# EAGLE design jat501 (EAGLE 9.5.1)
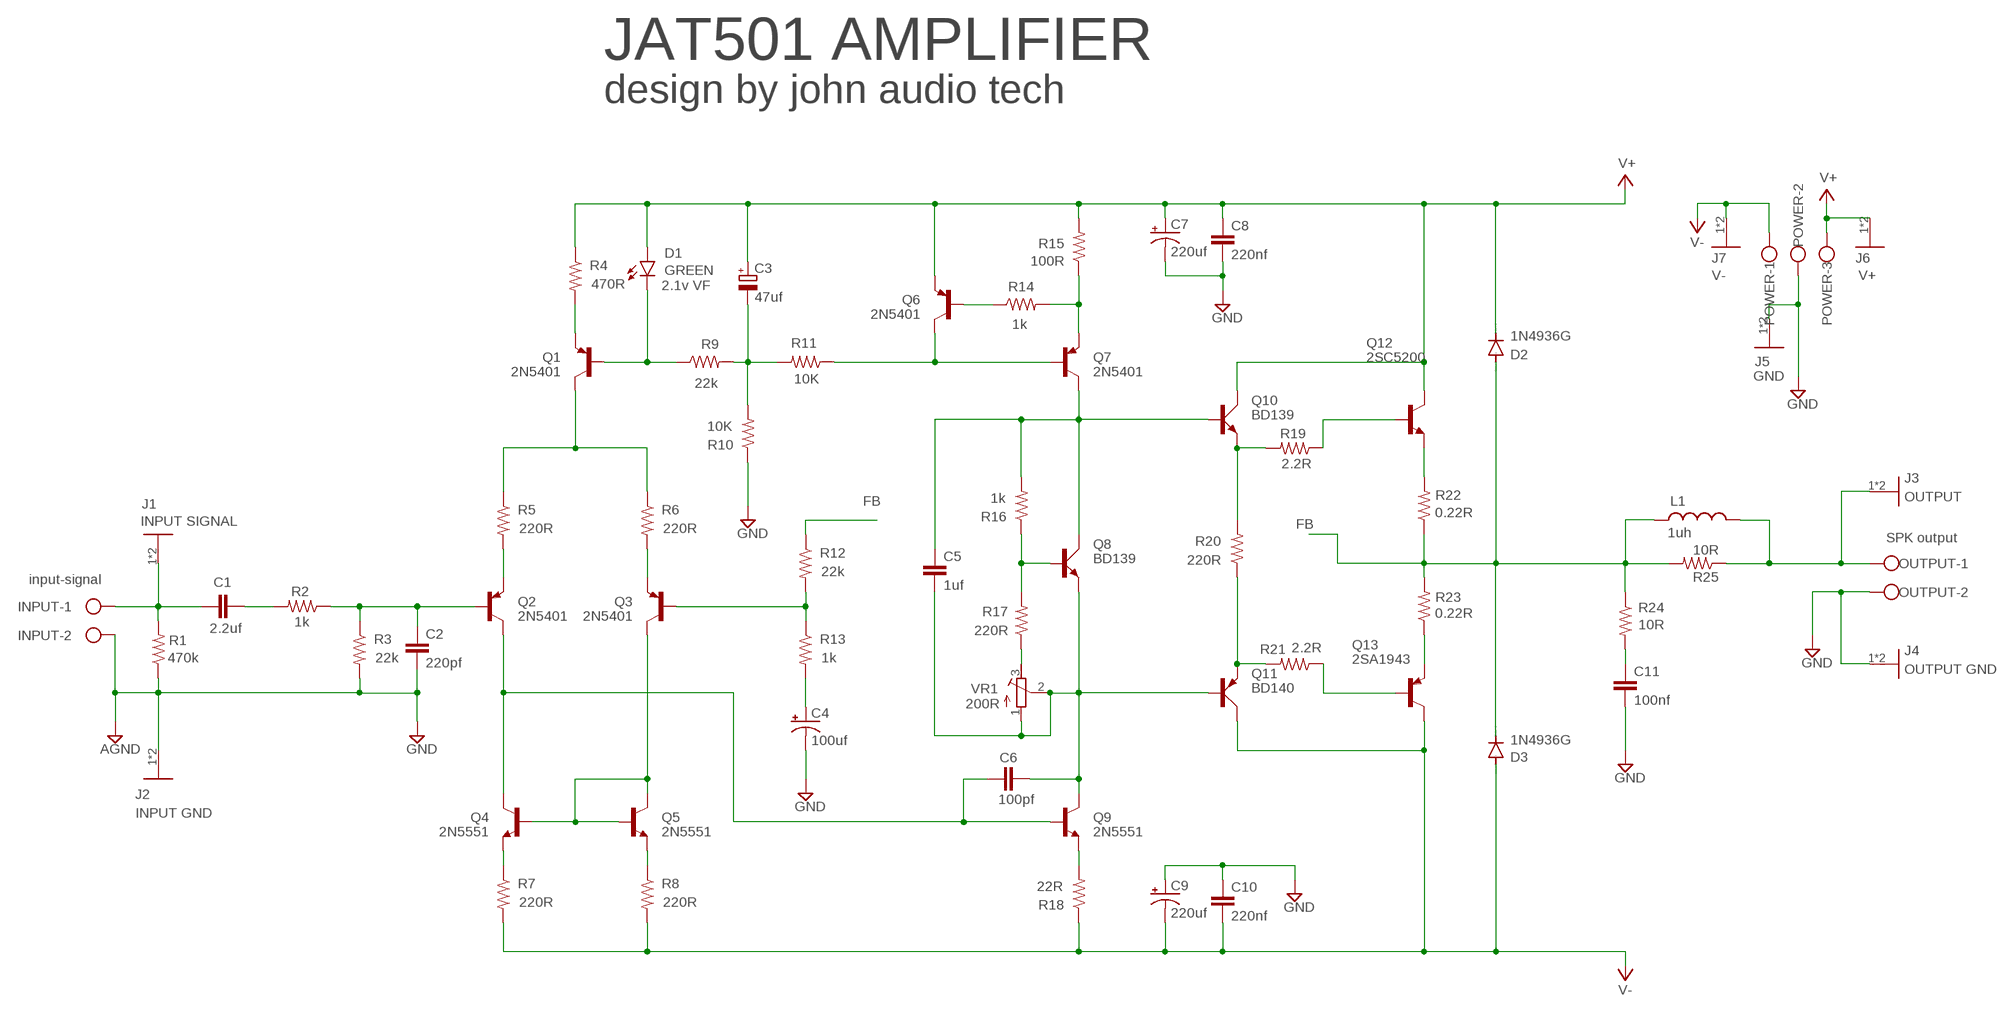
[diagram p0: schematic, sheet 1]

## Parts
C1  2.2uf  C-EU150-072X183  [C150-072X183]
C2  220pf  C-EU050-035X075  [C050-035X075]
C3  47uf  CPOL-EUE5-8.5  [E5-8,5]
C4  100uf  CPOL-USE5-13  [E5-13]
C5  1uf  C-EU075-063X106  [C075-063X106]
C6  100pf  C-EU050-035X075  [C050-035X075]
C7  220uf  CPOL-USE5-13  [E5-13]
C8  220nf  C-EU050-075X075  [C050-075X075]
C9  220uf  CPOL-USE5-13  [E5-13]
C10  220nf  C-EU050-075X075  [C050-075X075]
C11  100nf  C-EU050-075X075  [C050-075X075]
D1  GREEN  LED5MM-KIT  [LED_5MM-KIT]
D2  1N4936G  1N4933  [DO41-10]
D3  1N4936G  1N4933  [DO41-10]
INPUT  input-signal  W237-102  [W237-102]
J1  INPUT SIGNAL  1217861-1  [TE_1217861-1]
J2  INPUT GND  1217861-1  [TE_1217861-1]
J3  OUTPUT  1217861-1  [TE_1217861-1]
J4  OUTPUT GND  1217861-1  [TE_1217861-1]
J5  GND  1217861-1  [TE_1217861-1]
J6  V+  1217861-1  [TE_1217861-1]
J7  V-  1217861-1  [TE_1217861-1]
L1  1uh  L-USTFI0510  [TFI0510]
OUTPUT  SPK output  W237-102  [W237-102]
POWER  W237-103  [W237-103]
Q1  2N5401  [TO92-EBC]
Q2  2N5401  [TO92-EBC]
Q3  2N5401  [TO92-EBC]
Q4  2N5551  [TO92-EBC]
Q5  2N5551  [TO92-EBC]
Q6  2N5401  [TO92-EBC]
Q7  2N5401  [TO92-EBC]
Q8  BD139  [TO126AV]
Q9  2N5551  [TO92-EBC]
Q10  BD139  [TO126AV]
Q11  BD140  [TO126AV]
Q12  2SC5200  [TO-264]
Q13  2SA1943  [TO-264]
R1  470k  R-US_0207/10  [0207/10]
R2  1k  R-US_0207/10  [0207/10]
R3  22k  R-US_0207/10  [0207/10]
R4  470R  R-US_0207/10  [0207/10]
R5  220R  R-US_0207/10  [0207/10]
R6  220R  R-US_0207/10  [0207/10]
R7  220R  R-US_0207/10  [0207/10]
R8  220R  R-US_0207/10  [0207/10]
R9  22k  R-US_0207/10  [0207/10]
R10  10K  R-US_0207/10  [0207/10]
R11  10K  R-US_0207/10  [0207/10]
R12  22k  R-US_0207/10  [0207/10]
R13  1k  R-US_0207/10  [0207/10]
R14  1k  R-US_0207/10  [0207/10]
R15  100R  R-US_0207/10  [0207/10]
R16  1k  R-US_0207/10  [0207/10]
R17  220R  R-US_0207/10  [0207/10]
R18  22R  R-US_0207/10  [0207/10]
R19  2.2R  R-US_0207/10  [0207/10]
R20  220R  R-US_0207/10  [0207/10]
R21  2.2R  R-US_0207/10  [0207/10]
R22  0.22R  R-US_0922/22  [0922/22]
R23  0.22R  R-US_0922/22  [0922/22]
R24  10R  R-US_0922/22  [0922/22]
R25  10R  R-US_0922/22  [0922/22]
VR1  200R  R-TRIMM64W  [RTRIM64W]

## Nets
FB: D2.A D3.C L1.1 R12.1 R22.1 R23.2 R24.1 R25.2
GND: C2.2 C4.- C7.- C8.2 C9.+ C10.1 C11.2 INPUT.2 J2.1 J2.2 J4.1 J4.2 J5.1 J5.2 OUTPUT.2 POWER.2 R1.1 R3.2 R10.1 ; supply symbol labelled AGND
N$1: C1.1 INPUT.1 J1.1 J1.2 R1.2
N$2: C2.1 Q2.B R2.1 R3.1
N$3: C1.2 R2.2
N$4: Q1.C R5.1 R6.1
N$5: Q3.E R6.2
N$6: Q2.E R5.2
N$7: Q10.E R19.2 R20.2
N$9: Q3.C Q4.B Q5.B Q5.C
N$10: Q5.E R8.1
N$11: Q4.E R7.1
N$12: Q1.E R4.2
N$13: C11.1 R24.2
N$14: D1.K(C) Q1.B R9.1
N$15: C3.- R9.2 R10.2 R11.2
N$16: Q6.C Q7.B R11.1
N$17: Q3.B R12.2 R13.1
N$19: Q6.B R14.1
N$20: Q7.E R14.2 R15.1
N$21: C4.+ R13.2
N$22: C5.1 Q7.C Q8.C Q10.B R16.2
N$23: Q8.B R16.1 R17.2
N$24: R17.1 VR1.3(E)
N$25: Q9.E R18.2
N$26: C5.2 C6.1 Q8.E Q9.C Q11.B VR1.1(A) VR1.2(S)
N$27: C6.2 Q2.C Q4.C Q9.B
N$28: Q11.E R20.1 R21.2
N$29: Q12.B R19.1
N$30: Q13.B R21.1
N$31: Q13.E R23.1
N$32: Q12.E R22.2
OUTPUT: J3.1 J3.2 L1.2 OUTPUT.1 R25.1
V+: C3.+ C7.+ C8.1 D1.A D2.C J6.1 J6.2 POWER.3 Q6.E Q10.C Q12.C R4.1 R15.2
V-: C9.- C10.2 D3.A J7.1 J7.2 POWER.1 Q11.C Q13.C R7.2 R8.2 R18.1

## Notes on the sheet
- JAT501 AMPLIFIER
- design by john audio tech
- 2.1v VF

## Library data of the parts
C1 C2 C5 C6 C8 C10 C11 = rcl:C-EU: CAPACITOR, European symbol; SPICEPREFIX: C
C3 = rcl:CPOL-EU: POLARIZED CAPACITOR, European symbol; SPICEPREFIX: C
C4 C7 C9 = rcl:CPOL-US: POLARIZED CAPACITOR, American symbol; SPICEPREFIX: C
D1 = SparkFun-LED:LED: LED (Generic) Standard schematic elements and footprints for 5mm, 3mm, 1206, and 0603 sized LEDs. Generic LEDs with no color specified.
D2 D3 = diode:1N4933: DIODE fast recovery rectifier, 1A
INPUT OUTPUT = con-wago-500:W237-102: WAGO SCREW CLAMP; MPN: 237-102; OC_FARNELL: unknown; OC_NEWARK: 70K9898
J1-J7 = 1217861-1:1217861-1: FASTON 250 PCB TAB TPBR; AVAILABILITY: Unavailable; COMMENT: 1217861-1; DESCRIPTION: Solder Tab Terminal; Uninsulated; Tin over Copper Plated; Straight; 6.35x0.83mm; DIGIKEY-PURCHASE-URL: https://snapeda.com/shop?store=DigiKey&id=520868; MF: TE Connectivity; MP: 1217861-1; PACKAGE: None; PRICE: None
L1 = rcl:L-US: INDUCTOR, American symbol; SPICEPREFIX: L
POWER = con-wago-500:W237-103: WAGO SCREW CLAMP; MPN: 237-103; OC_FARNELL: unknown; OC_NEWARK: 18M7116
Q1-Q3 Q6 Q7 = 2n5xxx:2N5401: PNP Transistror 2n5401
Q4 Q5 Q9 = 2n5xxx:2N5551: NPN Transistror 2n5551
Q8 Q10 = transistor-power:BD139: NPN TRANSISTOR
Q11 = transistor-power:BD140: PNP TRANSISTOR
Q12 = TO264:2SC5200
Q13 = TO264:2SA1943
R1-R25 = rcl:R-US_: RESISTOR, American symbol; SPICEPREFIX: R
VR1 = rcl:R-TRIMM: Trimm resistor; SPICEMODEL: X; SPICEPREFIXL: POT

## Board
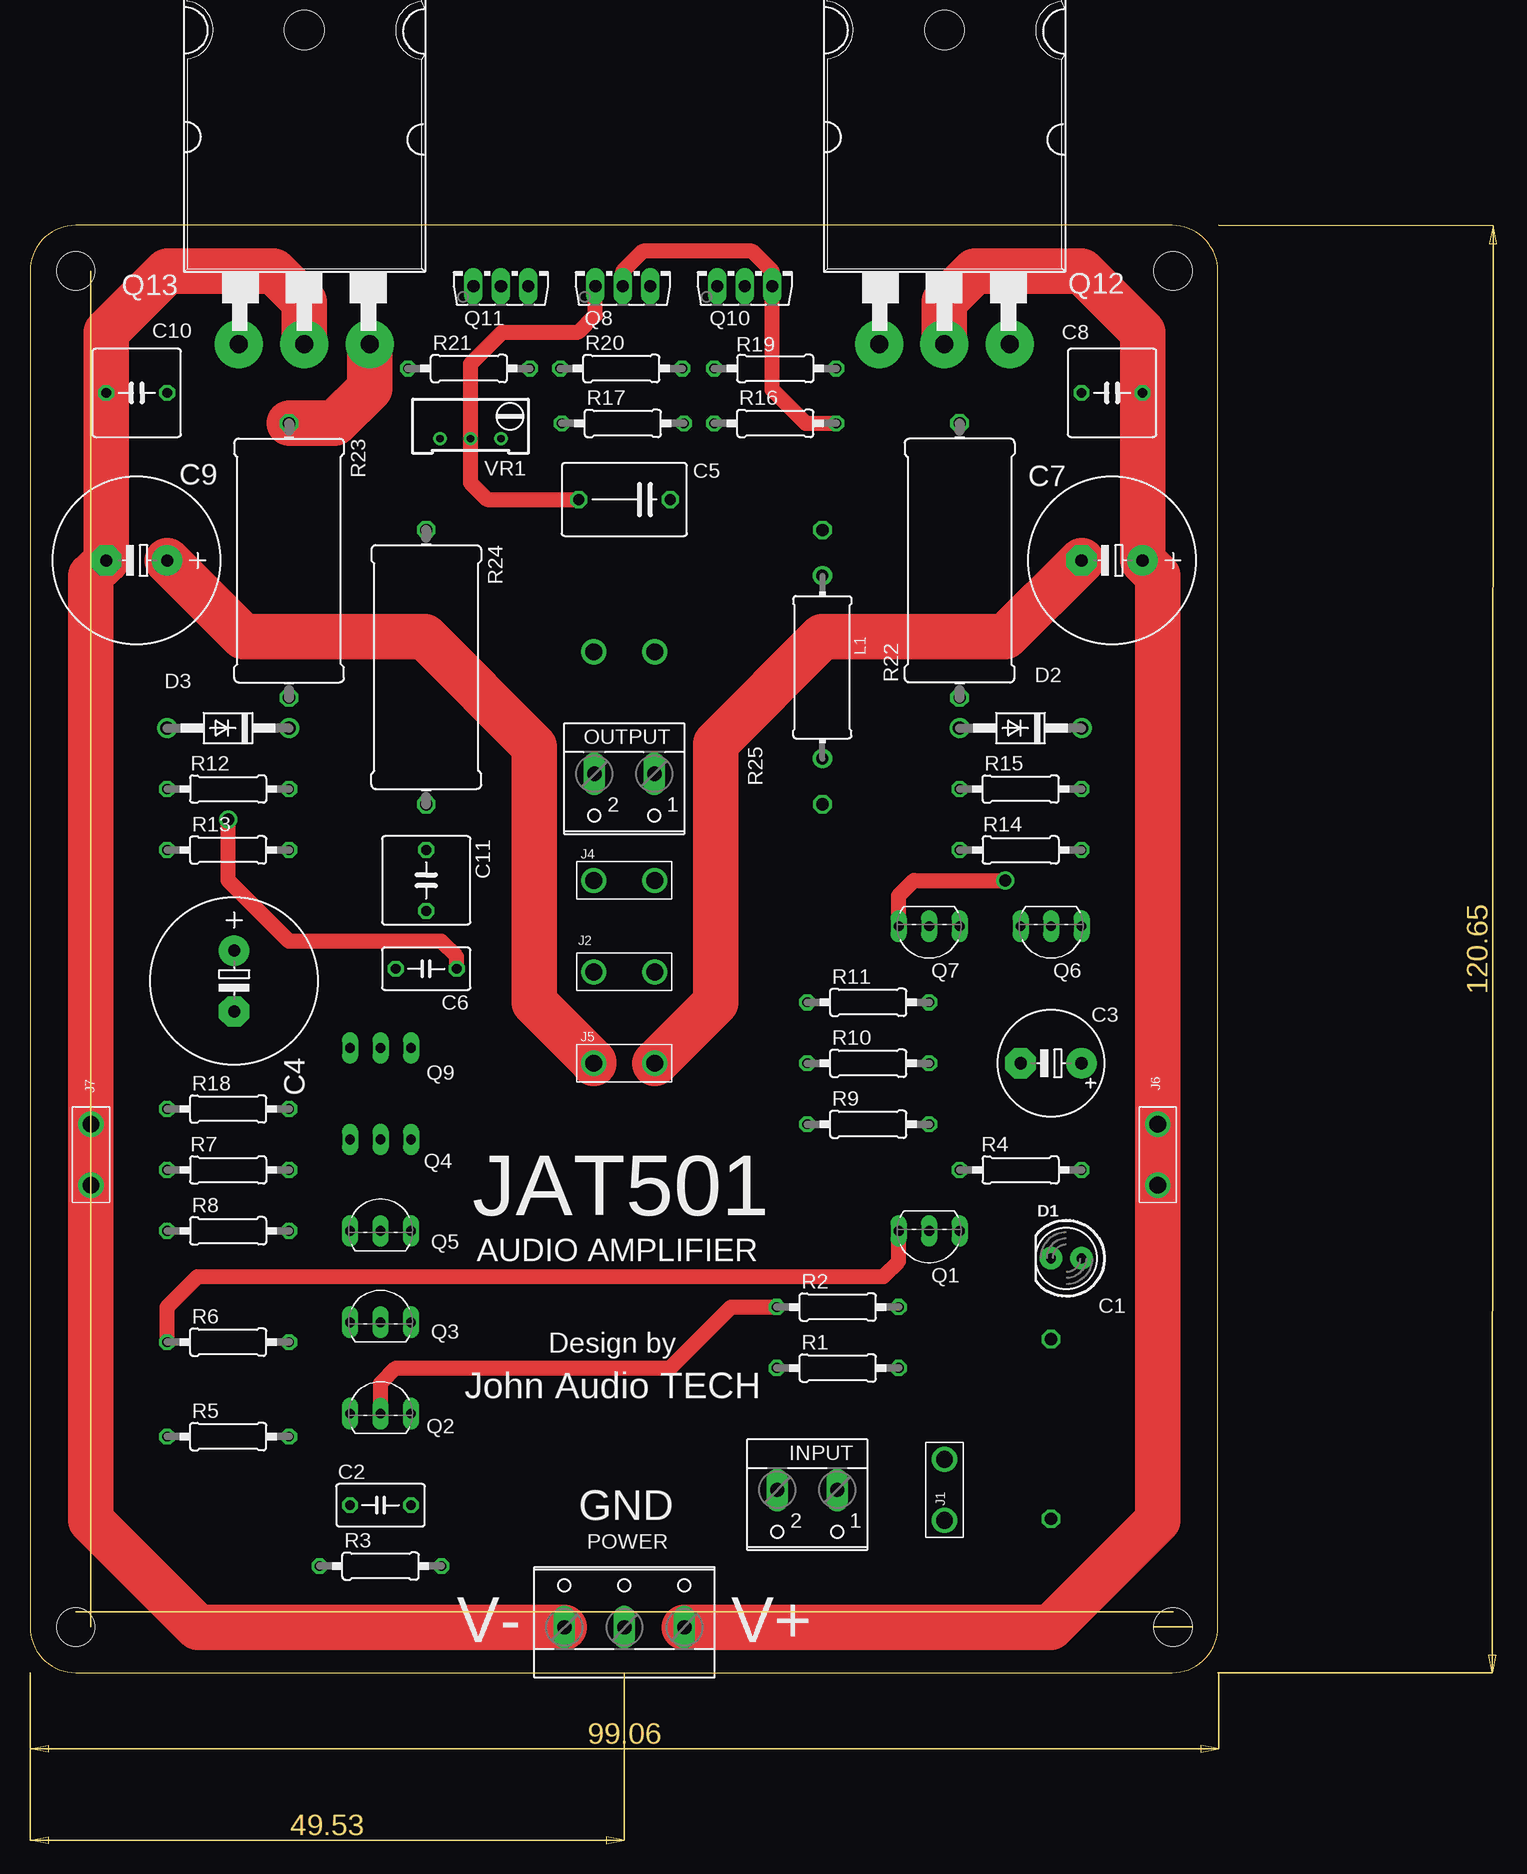
[diagram p1: board, top side]
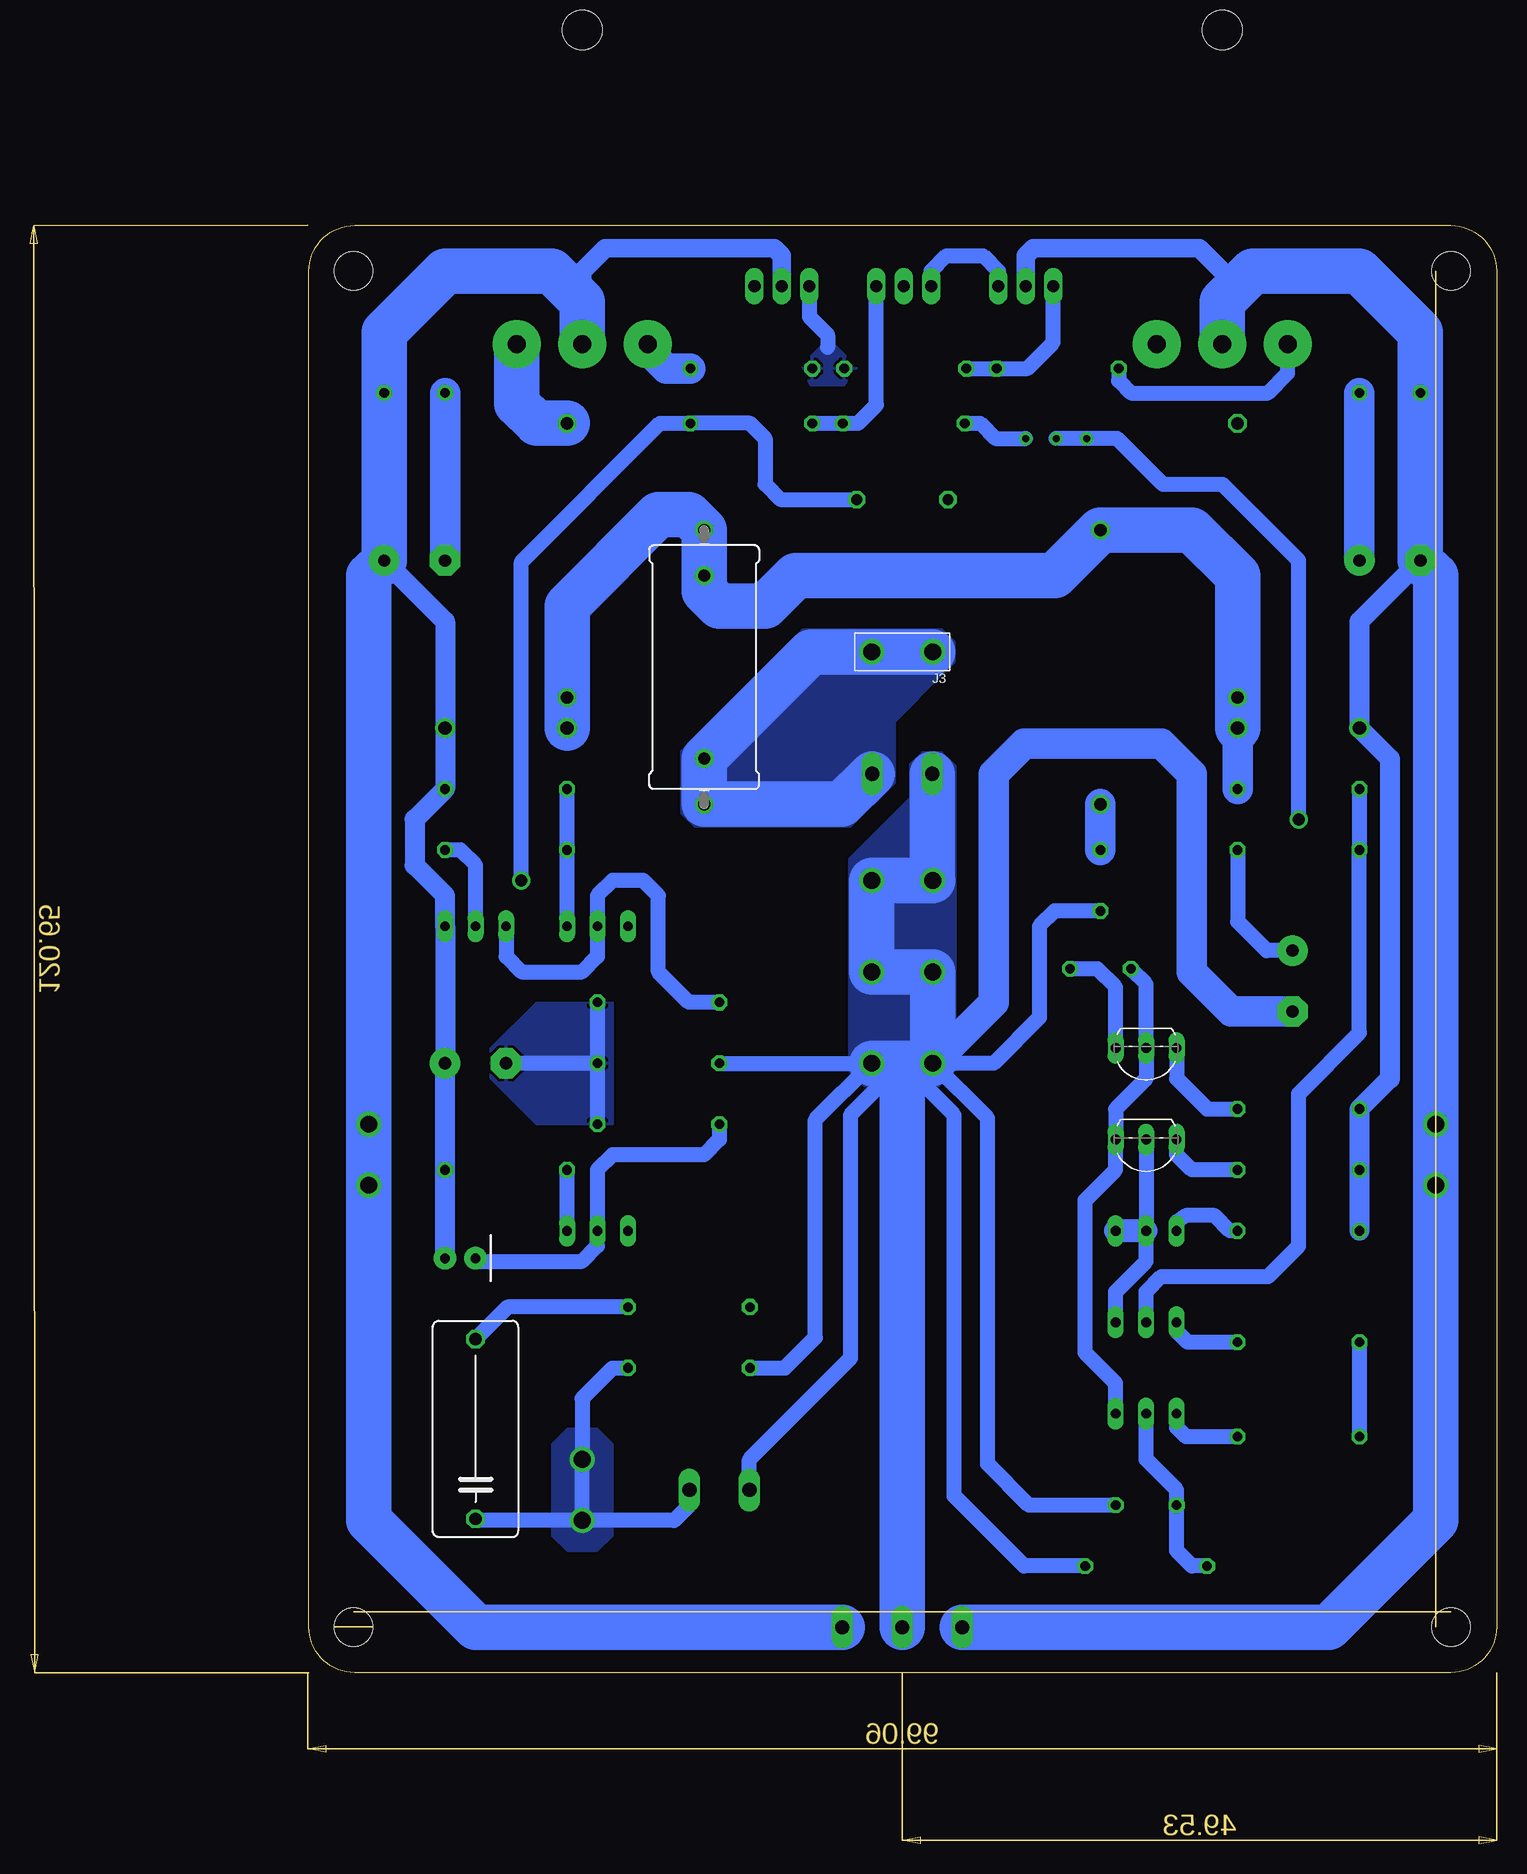
[diagram p2: board, bottom side, seen from below]

Size 98.98 x 120.64 mm. Coordinates in mm from the lower left corner, seen from the top.
Outline: 0,116.83 0,3.81 arc90 3.81,0 95.17,0 arc90 98.98,3.81 98.98,116.83 arc90 95.17,120.64 3.81,120.64 arc90 0,116.83
Copper layers (1*16): Top 0.035mm / dielectric 1.5mm / Bottom 0.035mm
Design rules "default": minimum track width 6mil, minimum drill 0.35mm, track to track 6mil, track to pad 6mil, pad to pad 6mil, via to via 6mil, smd to smd 6mil, copper to edge 40mil, drill to drill 6mil, minimum pad ring 10mil, minimum via ring 8mil, stop-mask expansion 4mil, vias tented up to drill 0mil, thermal gap 10mil
Holes 3.17 mm at 3.81,3.81 95.25,3.81 95.25,116.84 3.81,116.84

### Footprints (pad centres in the part's own frame; a part is rotated, then mirrored left to right if it is on the bottom)
C150-072X183 = drill 1.016 octagon: 1 -7.493,0; 2 7.493,0
C050-035X075 = drill 0.813 octagon: 1 -2.54,0; 2 2.54,0
E5-8,5 = drill 1.016 pad 2.54: + -2.54,0 | drill 1.016 pad 2.54 octagon: - 2.54,0
E5-13 = drill 1.016 pad 2.54: + -2.54,0 | drill 1.016 pad 2.54 octagon: - 2.54,0
C075-063X106 = drill 0.914 octagon: 1 -3.81,0; 2 3.81,0
C050-075X075 = drill 0.813 octagon: 1 -2.54,0; 2 2.54,0
LED_5MM-KIT = drill 0.813 pad 1.88: A -1.27,0; K 1.27,0
DO41-10 = drill 1.118: A 5.08,0; C -5.08,0
W237-102 = drill 1.194 long: 1 -2.5,-1.27; 2 2.5,-1.27
TE_1217861-1 = drill 1.4: 1 -2.54,0; 2 2.54,0
TFI0510 = drill 1 pad 1.6: 1 -7.62,0; 2 7.62,0
W237-103 = drill 1.194 long: 1 -5,-1.29; 2 0,-1.29; 3 5,-1.29
TO92-EBC = drill 0.813 long: B 0,-1.27; C 2.54,-1.27; E -2.54,-1.27
TO126AV = drill 1.016 long: B 2.286,-1.27; C 0,-1.27; E -2.286,-1.27
TO-264 = drill 1.5 pad 4: B -5.45,-6.096; E 5.45,-6.096 | drill 1.499 pad 4: C 0,-6.096 | hole 3.3: 0,20.09
0207/10 = drill 0.813 octagon: 1 -5.08,0; 2 5.08,0
0922/22 = drill 1.016 octagon: 1 -11.43,0; 2 11.43,0
RTRIM64W = drill 0.61: 1 1.27,-2.54; 2 1.27,0; 3 1.27,2.54

### Placement (x,y rotation side)
C1  85.09,20.32 90 bottom
C2  29.21,13.97 0 top
C3  85.09,50.8 180 top
C4  17.02,57.66 270 top
C5  49.53,97.79 180 top
C6  33.02,58.67 180 top
C7  90.17,92.71 180 top
C8  90.17,106.68 180 top
C9  8.89,92.71 180 top
C10  8.89,106.68 180 top
C11  33.02,66.04 270 top
D1  86.36,34.54 180 top
D2  82.55,78.74 180 top
D3  16.51,78.74 180 top
INPUT  64.77,13.97 180 top
J1  76.2,15.24 270 top
J2  49.53,58.42 180 top
J3  49.53,85.09 180 bottom
J4  49.53,66.04 0 top
J5  49.53,50.8 0 top
J6  93.98,43.18 90 top
J7  5.08,43.18 270 top
L1  66.04,83.82 270 top
OUTPUT  49.53,73.66 180 top
POWER  49.53,5.08 0 top
Q1  74.93,35.56 180 top
Q2  29.21,22.86 0 top
Q3  29.21,30.48 0 top
Q4  29.21,43.18 180 bottom
Q5  29.21,38.1 0 top
Q6  85.09,60.96 180 top
Q7  74.93,60.96 180 top
Q8  49.4,116.84 0 top
Q9  29.21,50.8 180 bottom
Q10  59.56,116.84 0 top
Q11  39.24,116.84 0 top
Q12  76.2,116.84 0 top
Q13  22.86,116.84 0 top
R1  67.31,25.4 0 top
R2  67.31,30.48 0 top
R3  29.21,8.89 0 top
R4  82.55,41.91 180 top
R5  16.51,19.68 0 top
R6  16.51,27.56 0 top
R7  16.51,41.91 180 top
R8  16.51,36.83 180 top
R9  69.85,45.72 0 top
R10  69.85,50.8 0 top
R11  69.85,55.88 0 top
R12  16.51,73.66 180 top
R13  16.51,68.58 0 top
R14  82.55,68.58 180 top
R15  82.55,73.66 0 top
R16  62.1,104.14 0 top
R17  49.4,104.14 0 top
R18  16.51,46.99 0 top
R19  62.1,108.71 180 top
R20  49.28,108.71 0 top
R21  36.58,108.71 0 top
R22  77.47,92.71 90 top
R23  21.59,92.71 270 top
R24  33.02,83.82 270 top
R25  66.04,83.82 90 bottom
VR1  36.7,104.14 270 top

### Tracks (layer width: path | path; a pad name or v marks a point on that pad's centre or on a via)
FB
  Bottom 2.54: R12.1 D3.C
  Bottom 3.81: D3.C R23.2 21.59,91.44 25.4,95.25 R24.1 36.83,91.44 58.42,91.44 60.96,88.9 64.77,88.9 66.04,90.17 L1.1 R25.2 67.31,96.52 69.85,96.52 77.47,88.9 R22.1 D2.A
GND
  Top 3.81: C7.- 81.28,86.36 66.04,86.36 57.15,77.47 57.15,55.88 J5.2 | C9.+ 17.78,86.36 32.89,86.36 42.04,77.22 42.04,55.88 46.99,50.93 J5.1
  Bottom 1.27: R3.2 39.37,8.89 45.21,14.73 45.21,46.48 49.53,50.8 53.85,46.48 53.85,26.2 62.27,17.78 INPUT.2 | R1.1 59.31,25.4 56.77,27.94 56.77,46.1 J5.2 R10.1 | C2.2 38.99,13.97 42.42,17.4 42.42,46.23 J5.1 41.91,50.8 38.1,54.61 38.1,62.23 36.83,63.5 C11.2
  Bottom 2.54: C10.1 C9.+ | C8.2 C7.- | C4.- 22.1,55.12 25.4,58.42 25.4,74.93 27.94,77.47 39.37,77.47 41.91,74.93 41.91,55.88 J5.1
  Bottom 3.81: OUTPUT.2 47.03,66.08 J4.1 J4.2 J2.1 J2.2 J5.1 49.53,50.8 | 49.53,50.8 J5.2 | POWER.2 49.53,50.8
  pour Bottom (no thermals): 48.9,75.69 48.9,72.9 53.98,67.82 53.98,50.16 52.7,48.9 46.48,48.9 45.09,50.29 45.09,75.56 46.23,76.71 47.88,76.71
N$1
  Bottom 1.27: INPUT.1 67.27,13.97 68.54,12.7 J1.2 | J1.2 84.96,12.7 C1.1 | J1.2 J1.1 76.2,22.86 73.66,25.4 R1.2
  pour Bottom (no thermals): 77.47,20.32 78.74,19.05 78.74,11.43 77.47,10.16 74.93,10.16 73.66,11.43 73.66,19.05 74.93,20.32
N$2
  Top 1.27: Q2.B 29.21,24.13 30.48,25.4 53.34,25.4 58.42,30.48 R2.1
  Bottom 1.27: R3.1 25.4,8.89 26.67,10.16 C2.1 26.67,15.24 29.21,17.78 Q2.B
N$3
  Bottom 1.27: R2.2 82.42,30.48 C1.2
N$4
  Top 1.27: R6.1 11.43,30.48 13.97,33.02 71.12,33.02 72.39,34.29 Q1.C
  Bottom 1.27: R6.1 R5.1
N$5
  Bottom 1.27: Q3.E 26.67,28.45 25.78,27.56 R6.2
N$6
  Bottom 1.27: Q2.E 26.67,20.45 25.91,19.68 R5.2
N$7
  Bottom 1.27: Q10.E 57.28,113.03 55.75,111.51 55.75,110.49
  pour Bottom: 56.26,110.62 55.12,110.62 53.31,108.8 54.4,107.31 57.12,107.31 57.86,109.02
N$9
  Bottom 1.27: Q4.B Q5.B 29.21,34.29 31.75,31.75 Q3.C
  Bottom 1.905: Q5.B Q5.C
N$10
  Bottom 1.27: R8.1 22.23,36.83 23.5,38.1 25.91,38.1 26.67,37.59 Q5.E
N$11
  Bottom 1.27: R7.1 25.4,41.91 26.67,43.18 Q4.E
N$12
  Bottom 1.27: Q1.E R4.2
N$13
  Bottom 2.54: R24.2 C11.1
N$14
  Bottom 1.27: D1.K 84.84,34.29 76.2,34.29 74.93,35.56 Q1.B 74.93,41.91 73.66,43.18 66.04,43.18 64.77,44.45 R9.1
N$15
  Bottom 1.27: R11.2 R10.2 | R10.2 R9.2 | R10.2 C3.-
  pour Bottom: 73.66,55.88 73.66,45.72 80.01,45.72 83.82,49.53 83.82,52.07 80.01,55.88
N$16
  Bottom 1.27: Q6.C 82.55,59.69 81.28,58.42 76.2,58.42 74.93,59.69 Q7.B 74.93,64.77 73.66,66.04 71.12,66.04 69.85,64.77 69.85,58.42 67.31,55.88 R11.1
N$17
  Bottom 1.27: R12.2 R13.1 11.43,53.34 16.51,48.26 16.51,35.56 19.05,33.02 27.94,33.02 29.21,31.75 Q3.B
N$19
  Bottom 1.27: Q6.B 85.09,67.31 86.36,68.58 R14.1
N$20
  Bottom 1.27: Q7.E R14.2 R15.1
N$21
  Bottom 1.27: R13.2 21.59,62.61 19.18,60.2 C4.+
N$22  (via drill 1)
  Top 1.27: Q8.C 49.4,116.84 51.05,118.49 60.2,118.49 61.85,116.84 Q10.B 61.85,106.93 64.64,104.14 R16.2 | Q7.C 72.39,64.77 73.66,66.04 v81.28,66.04
  Bottom 1.27: C5.1 59.69,97.79 60.96,99.06 60.96,102.87 62.23,104.14 R16.2 69.72,104.14 81.28,92.58 v81.28,66.04
N$23
  Bottom 1.27: Q8.B 51.69,105.66 53.21,104.14 R17.2 R16.1
N$24
  Bottom 1.27: R17.1 43.05,104.14 41.78,102.87 VR1.3
N$25
  Bottom 1.27: Q9.E 26.67,49.53 24.13,46.99 R18.2
N$26  (via drill 1)
  Top 1.27: C6.1 35.56,59.69 34.29,60.96 21.59,60.96 16.51,66.04 v16.51,71.12 | C5.2 38.1,97.79 36.7,99.19 VR1.2 36.7,109.09 39.37,111.76 45.72,111.76 47.12,113.16 Q8.E
  Bottom 1.27: Q8.E 47.12,116.84 45.85,118.11 42.8,118.11 41.53,116.84 Q11.B | Q9.C 31.75,57.15 33.27,58.67 C6.1 | v16.51,71.12 16.51,92.71 22.86,99.06 27.81,99.06 31.62,102.87 VR1.1 VR1.2
N$27
  Bottom 1.27: Q2.C 31.75,24.13 34.29,26.67 34.29,39.37 31.75,41.91 Q4.C 31.75,46.99 29.21,49.53 Q9.B 29.21,57.4 C6.2
N$28
  Bottom 1.27: R20.1 R21.2 39.12,108.71 36.96,110.87 Q11.E
N$29
  Bottom 2.54: R19.1 69.22,108.71 70.75,110.25 Q12.B
N$30
  Bottom 1.27: R21.1 31.5,107.7 30.48,106.68 19.05,106.68 17.41,108.32 Q13.B
N$31
  Top 3.81: Q13.E 28.31,107.05 25.4,104.14 R23.1
N$32
  Bottom 3.81: Q12.E 81.65,105.78 80.01,104.14 R22.2
OUTPUT
  Bottom 3.81: J3.1 J3.2 57.15,85.09 L1.2 R25.1 54.57,72.39 OUTPUT.1
  pour Bottom (no thermals): 53.47,87 46.23,87 45.21,85.98 45.21,84.2 46.1,83.31 50.16,79.25 50.16,74.17 53.85,70.48 66.42,70.48 66.8,70.48 67.94,71.63 67.94,76.83 57.91,86.87 57.78,87 53.59,87
V+
  Top 3.81: POWER.3 85.07,3.79 93.98,12.7 J6.1 J6.2 93.98,91.44 C7.+ C8.1 92.71,111.76 87.63,116.84 78.74,116.84 76.2,114.3 Q12.C
  Bottom 1.524: Q10.C 59.56,118.11 60.2,118.75 74.3,118.75 76.2,116.84 76.2,114.3
  Bottom 1.651: C7.+ 87.63,87.63 D2.C R15.2 90.17,71.12 90.17,67.31 87.63,64.77 Q6.E C3.+ R4.1 D1.A
  Bottom 3.81: Q12.C 76.2,114.3 78.74,116.84 87.63,116.84 92.71,111.76 C8.1 C7.+ 93.98,91.44 J6.1 93.98,12.7 85.07,3.79 POWER.3
V-
  Top 3.81: POWER.1 13.99,3.79 5.08,12.7 J7.2 J7.1 5.08,91.44 C9.- C10.2 6.35,111.76 11.43,116.84 20.32,116.84 22.86,114.3 Q13.C
  Bottom 1.27: 22.86,116.84 22.86,114.3
  Bottom 1.524: Q11.C 39.24,118.11 38.61,118.75 24.77,118.75 22.86,116.84
  Bottom 1.651: C9.- 11.43,87.63 D3.A 8.89,76.2 8.89,49.53 R18.1 R7.2 R8.2
  Bottom 3.81: Q13.C 22.86,114.3 20.32,116.84 11.43,116.84 6.35,111.76 C9.- 5.08,91.44 J7.2 5.08,12.7 13.99,3.79 POWER.1

### Text on the board
tNames: JAT501 | AUDIO AMPLIFIER | Design by | John Audio TECH | GND | V- | V+